# Altium schematic sheet 01-Overview.SchDoc
size A4
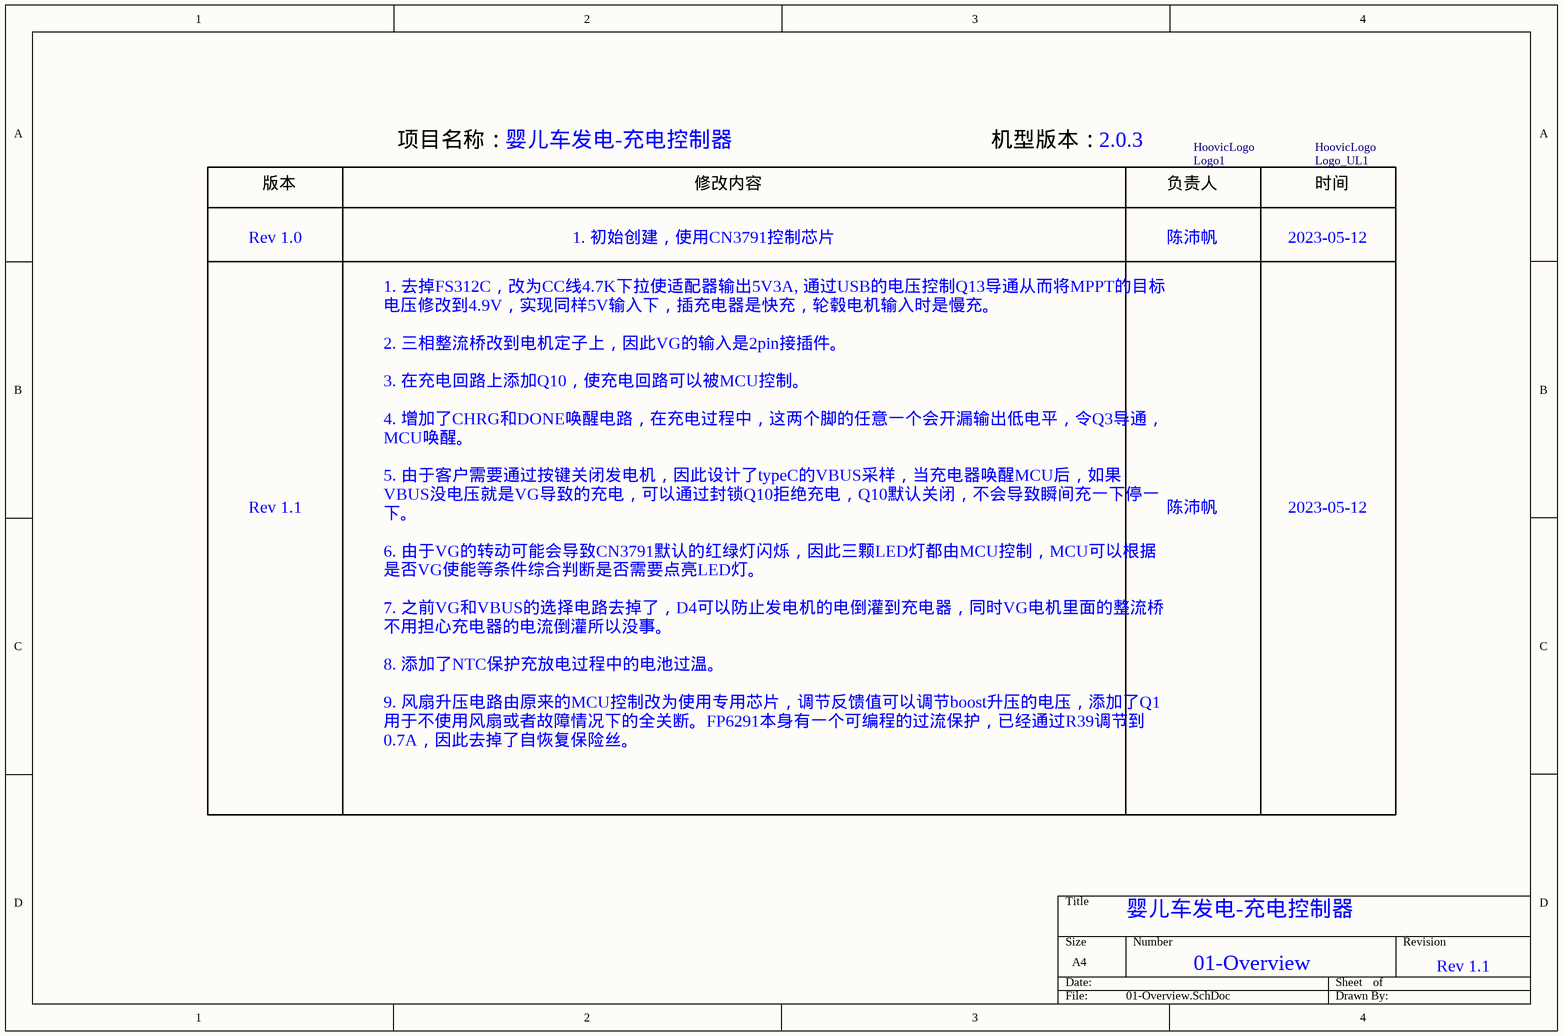
[diagram p0: 01-Overview.SchDoc]

## Parts
Logo1  Logo  [HoovicLogo_8mm]  (value not drawn)
Logo_UL1  Logo  [UL_LOGO_3MM]  (value not drawn)

## Notes on the sheet
- 项目名称：
- 婴儿车发电-充电控制器
- 机型版本：
- 2.0.3
- Rev 1.0
- 版本
- 1. 初始创建，使用CN3791控制芯片
- 修改内容
- (near Logo1) 负责人
- 陈沛帆
- 2023-05-12
- (near Logo_UL1) 时间
- Rev 1.1
- 1. 去掉FS312C，改为CC线4.7K下拉使适配器输出5V3A, 通过USB的电压控制Q13导通从而将MPPT的目标电压修改到4.9V，实现同样5V输入下，插充电器是快充，轮毂电机输入时是慢充。
  2. 三相整流桥改到电机定子上，因此VG的输入是2pin接插件。
  3. 在充电回路上添加Q10，使充电回路可以被MCU控制。
  4. 增加了CHRG和DONE唤醒电路，在充电过程中，这两个脚的任意一个会开漏输出低电平，令Q3导通，MCU唤醒。
  5. 由于客户需要通过按键关闭发电机，因此设计了typeC的VBUS采样，当充电器唤醒MCU后，如果VBUS没电压就是VG导致的充电，可以通过封锁Q10拒绝充电，Q10默认关闭，不会导致瞬间充一下停一下。
  6. 由于VG的转动可能会导致CN3791默认的红绿灯闪烁，因此三颗LED灯都由MCU控制，MCU可以根据是否VG使能等条件综合判断是否需要点亮LED灯。
  7. 之前VG和VBUS的选择电路去掉了，D4可以防止发电机的电倒灌到充电器，同时VG电机里面的整流桥不用担心充电器的电流倒灌所以没事。
  8. 添加了NTC保护充放电过程中的电池过温。
  9. 风扇升压电路由原来的MCU控制改为使用专用芯片，调节反馈值可以调节boost升压的电压，添加了Q1用于不使用风扇或者故障情况下的全关断。FP6291本身有一个可编程的过流保护，已经通过R39调节到0.7A，因此去掉了自恢复保险丝。
- 01-Overview
- (in symbol Logo) HoovicLogo